# EAGLE design schematic (EAGLE 9.0.0)

## Sheet 1 of 4
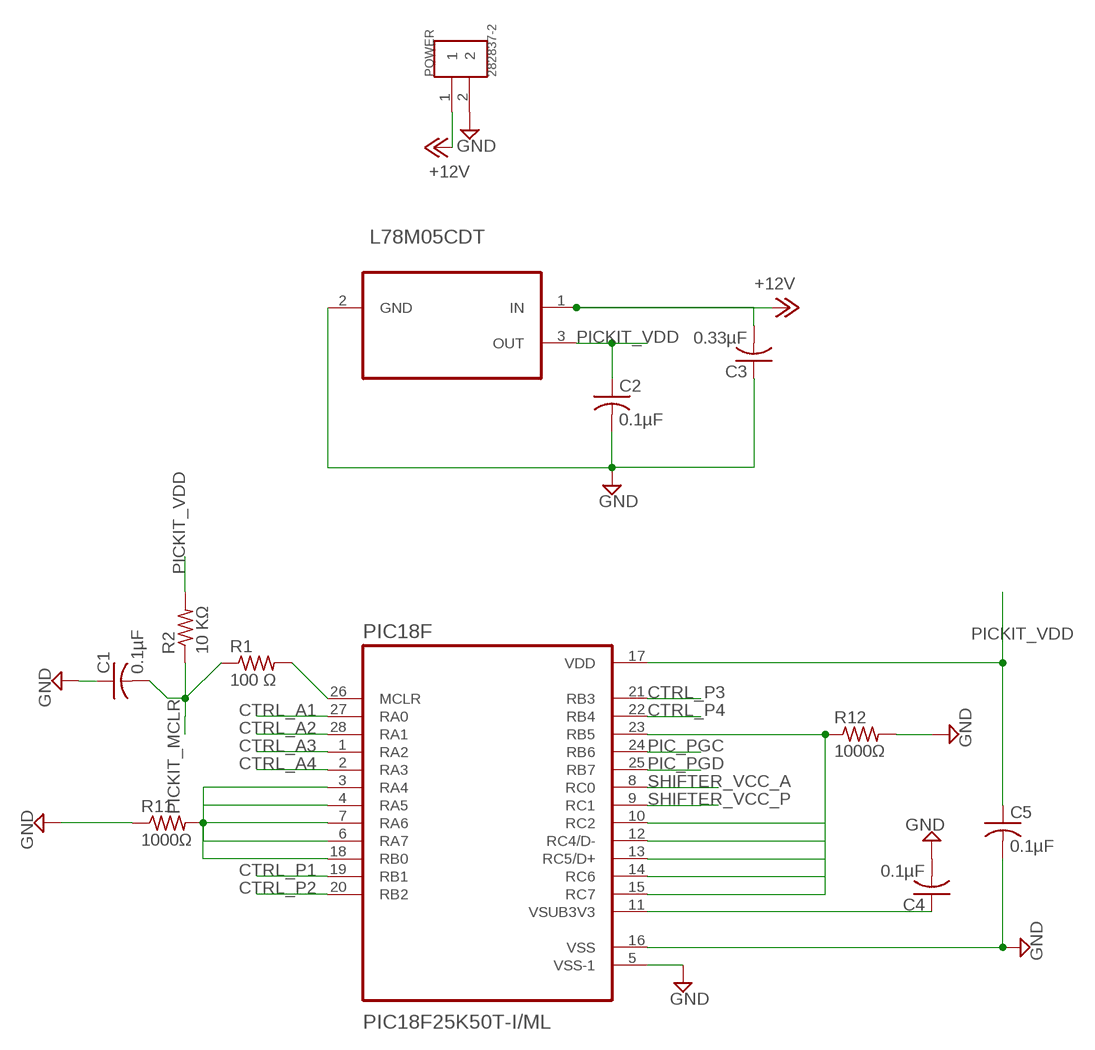
[diagram p0: schematic, sheet 1]

### Parts
C1  0.1µF  C-USC0603  [C0603]
C2  0.1µF  C-USC0603  [C0603]
C3  0.33µF  C-USC0603  [C0603]
C4  0.1µF  C-USC0603  [C0603]
C5  0.1µF  C-USC0603  [C0603]
L78M05CDT  L78M05CDT  [TO225P972X240-3N]
PIC18F  PIC18F25K50T-I/ML  [QFN65P600X600X100-29N]
POWER  282837-2  [TE_282837-2]
R1  100 Ω  R-US_R0805  [R0805]
R2  10 KΩ  R-US_R0805  [R0805]
R11  1000Ω  R-US_R0603  [R0603]
R12  1000Ω  R-US_R0603  [R0603]

### Nets
+12V: C3.2 L78M05CDT.1(IN) POWER.1 ; also sheet 2,3
CTRL_A1: PIC18F.27(RA0) ; also sheet 2
CTRL_A2: PIC18F.28(RA1) ; also sheet 2
CTRL_A3: PIC18F.1(RA2) ; also sheet 2
CTRL_A4: PIC18F.2(RA3) ; also sheet 2
CTRL_P1: PIC18F.19(RB1) ; also sheet 2
CTRL_P2: PIC18F.20(RB2) ; also sheet 2
CTRL_P3: PIC18F.21(RB3) ; also sheet 2
CTRL_P4: PIC18F.22(RB4) ; also sheet 2
GND: C1.1 C2.2 C3.1 C4.2 C5.2 L78M05CDT.2(GND) PIC18F.5(VSS-1) PIC18F.16(VSS) POWER.2 R11.1 R12.2 ; also sheet 2,3,4
N$1: C4.1 PIC18F.11(VSUB3V3)
N$3: PIC18F.3(RA4) PIC18F.4(RA5) PIC18F.6(RA7) PIC18F.7(RA6) PIC18F.18(RB0) R11.2
N$6: PIC18F.26(MCLR) R1.2
N$12: PIC18F.10(RC2) PIC18F.12(RC4/D-) PIC18F.13(RC5/D+) PIC18F.14(RC6) PIC18F.15(RC7) PIC18F.23(RB5) R12.1
PIC_PGC: PIC18F.24(RB6) ; also sheet 4
PIC_PGD: PIC18F.25(RB7) ; also sheet 4
PICKIT_MCLR: C1.2 R1.1 R2.1 ; also sheet 4
PICKIT_VDD: C2.1 C5.1 L78M05CDT.3(OUT) PIC18F.17(VDD) R2.2 ; also sheet 4
SHIFTER_VCC_A: PIC18F.8(RC0) ; also sheet 2
SHIFTER_VCC_P: PIC18F.9(RC1) ; also sheet 2

## Sheet 2 of 4
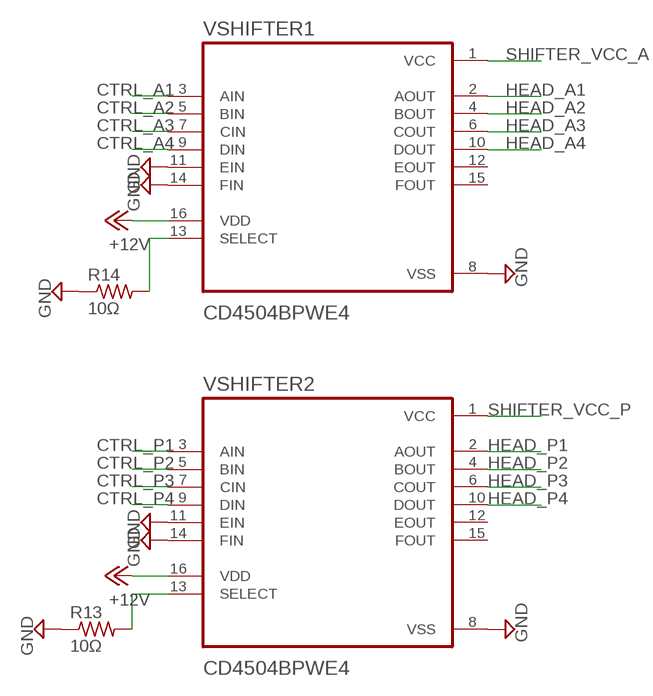
[diagram p1: schematic, sheet 2]

### Parts
R13  10Ω  R-US_R0603  [R0603]
R14  10Ω  R-US_R0603  [R0603]
VSHIFTER1  CD4504BPWE4  [SOP65P640X120-16N]
VSHIFTER2  CD4504BPWE4  [SOP65P640X120-16N]

### Nets
+12V: VSHIFTER1.16(VDD) VSHIFTER2.16(VDD) ; also sheet 1,3
CTRL_A1: VSHIFTER1.3(AIN) ; also sheet 1
CTRL_A2: VSHIFTER1.5(BIN) ; also sheet 1
CTRL_A3: VSHIFTER1.7(CIN) ; also sheet 1
CTRL_A4: VSHIFTER1.9(DIN) ; also sheet 1
CTRL_P1: VSHIFTER2.3(AIN) ; also sheet 1
CTRL_P2: VSHIFTER2.5(BIN) ; also sheet 1
CTRL_P3: VSHIFTER2.7(CIN) ; also sheet 1
CTRL_P4: VSHIFTER2.9(DIN) ; also sheet 1
GND: R13.1 R14.1 VSHIFTER1.8(VSS) VSHIFTER1.11(EIN) VSHIFTER1.14(FIN) VSHIFTER2.8(VSS) VSHIFTER2.11(EIN) VSHIFTER2.14(FIN) ; also sheet 1,3,4
HEAD_A1: VSHIFTER1.2(AOUT) ; also sheet 3
HEAD_A2: VSHIFTER1.4(BOUT) ; also sheet 3
HEAD_A3: VSHIFTER1.6(COUT) ; also sheet 3
HEAD_A4: VSHIFTER1.10(DOUT) ; also sheet 3
HEAD_P1: VSHIFTER2.2(AOUT) ; also sheet 3
HEAD_P2: VSHIFTER2.4(BOUT) ; also sheet 3
HEAD_P3: VSHIFTER2.6(COUT) ; also sheet 3
HEAD_P4: VSHIFTER2.10(DOUT) ; also sheet 3
N$13: R14.2 VSHIFTER1.13(SELECT)
N$14: R13.2 VSHIFTER2.13(SELECT)
SHIFTER_VCC_A: VSHIFTER1.1(VCC) ; also sheet 1
SHIFTER_VCC_P: VSHIFTER2.1(VCC) ; also sheet 1
Unconnected: VSHIFTER1.12(EOUT) VSHIFTER1.15(FOUT) VSHIFTER2.12(EOUT) VSHIFTER2.15(FOUT)

## Sheet 3 of 4
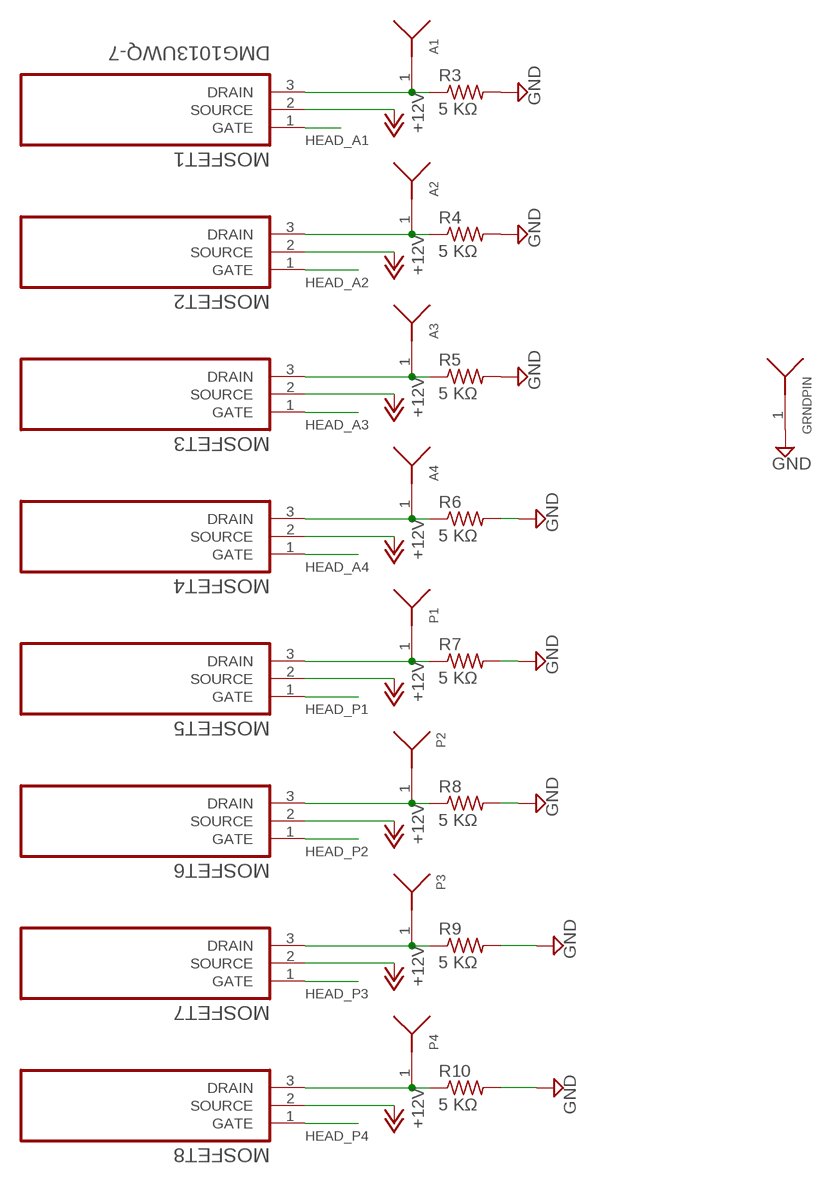
[diagram p2: schematic, sheet 3]

### Parts
A1  0930  [0930]
A2  0930  [0930]
A3  0930  [0930]
A4  0930  [0930]
GRNDPIN  0930  [0930]
MOSFET1  DMG1013UWQ-7  [SOT65P210X110-3N]
MOSFET2  DMG1013UWQ-7  [SOT65P210X110-3N]
MOSFET3  DMG1013UWQ-7  [SOT65P210X110-3N]
MOSFET4  DMG1013UWQ-7  [SOT65P210X110-3N]
MOSFET5  DMG1013UWQ-7  [SOT65P210X110-3N]
MOSFET6  DMG1013UWQ-7  [SOT65P210X110-3N]
MOSFET7  DMG1013UWQ-7  [SOT65P210X110-3N]
MOSFET8  DMG1013UWQ-7  [SOT65P210X110-3N]
P1  0930  [0930]
P2  0930  [0930]
P3  0930  [0930]
P4  0930  [0930]
R3  5 KΩ  R-US_R0603  [R0603]
R4  5 KΩ  R-US_R0603  [R0603]
R5  5 KΩ  R-US_R0603  [R0603]
R6  5 KΩ  R-US_R0603  [R0603]
R7  5 KΩ  R-US_R0603  [R0603]
R8  5 KΩ  R-US_R0603  [R0603]
R9  5 KΩ  R-US_R0603  [R0603]
R10  5 KΩ  R-US_R0603  [R0603]

### Nets
+12V: MOSFET1.2(SOURCE) MOSFET2.2(SOURCE) MOSFET3.2(SOURCE) MOSFET4.2(SOURCE) MOSFET5.2(SOURCE) MOSFET6.2(SOURCE) MOSFET7.2(SOURCE) MOSFET8.2(SOURCE) ; also sheet 1,2
GND: GRNDPIN.1 R3.2 R4.2 R5.2 R6.2 R7.2 R8.2 R9.2 R10.2 ; also sheet 1,2,4
HEAD_A1: MOSFET1.1(GATE) ; also sheet 2
HEAD_A2: MOSFET2.1(GATE) ; also sheet 2
HEAD_A3: MOSFET3.1(GATE) ; also sheet 2
HEAD_A4: MOSFET4.1(GATE) ; also sheet 2
HEAD_P1: MOSFET5.1(GATE) ; also sheet 2
HEAD_P2: MOSFET6.1(GATE) ; also sheet 2
HEAD_P3: MOSFET7.1(GATE) ; also sheet 2
HEAD_P4: MOSFET8.1(GATE) ; also sheet 2
N$2: A1.1 MOSFET1.3(DRAIN) R3.1
N$4: A2.1 MOSFET2.3(DRAIN) R4.1
N$5: A3.1 MOSFET3.3(DRAIN) R5.1
N$7: A4.1 MOSFET4.3(DRAIN) R6.1
N$8: MOSFET5.3(DRAIN) P1.1 R7.1
N$9: MOSFET6.3(DRAIN) P2.1 R8.1
N$10: MOSFET7.3(DRAIN) P3.1 R9.1
N$11: MOSFET8.3(DRAIN) P4.1 R10.1

## Sheet 4 of 4
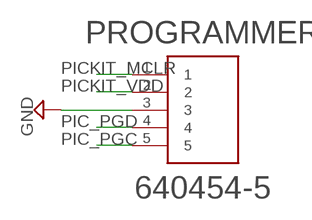
[diagram p3: schematic, sheet 4]

### Parts
PROGRAMMER  640454-5  [TE_640454-5]

### Nets
GND: PROGRAMMER.3 ; also sheet 1,2,3
PIC_PGC: PROGRAMMER.5 ; also sheet 1
PIC_PGD: PROGRAMMER.4 ; also sheet 1
PICKIT_MCLR: PROGRAMMER.1 ; also sheet 1
PICKIT_VDD: PROGRAMMER.2 ; also sheet 1

## Library data of the parts
A1-A4 GRNDPIN P1-P4 = 0930:0930: LOW PROFILE SPRING PIN; AVAILABILITY: Good; DESCRIPTION: SPRING LOADED PIN; Connector Tip Style: Point; Current Rating: 2A; Overall Length:; MF: Mill-Max Manufacturing; MP: 0926-1-15-20-75-14-11-0; OC_NEWARK: unknown; PACKAGE: None; PRICE: 0.56 USD
C1 C2 C4 C5 = rcl:C-US: CAPACITOR, American symbol; MPN: B32529C0104J000; OC_NEWARK: 26M8219; SPICEPREFIX: C
C3 = rcl:C-US: CAPACITOR, American symbol; OC_NEWARK: unknown; SPICEPREFIX: C
L78M05CDT = L78M05CDT:L78M05CDT: Positive voltage regulators; AVAILABILITY: Good; DESCRIPTION: L78M Series 500 mA 5 V Three Terminal Positive Voltage LDO Regulator - TO-252; MF: STMicroelectronics; MP: L78M05CDT-TR; PACKAGE: TO-252-3 STMicroelectronics; PRICE: 0.21 USD
MOSFET1-MOSFET8 = DMG1013UWQ-7:DMG1013UWQ-7: None; AVAILABILITY: Good; DESCRIPTION: Mosfet Bvdss: 8v~24v Sot323 t&r 3k; MP: DMG1013UWQ-7; OC_NEWARK: unknown; PACKAGE: SOT-323 Diodes Inc.; PRICE: 0.15 USD
PIC18F = PIC18F25K50T-I_ML:PIC18F25K50T-I/ML: None; AVAILABILITY: Good; DESCRIPTION: 32 KB Flash, 2048 bytes RAM, 48 MHz Int. Osc, 25 I/0, PIC18 Core, USB 2.0; MF: Microchip; MP: PIC18F25K50T-I/ML; OC_NEWARK: unknown; PACKAGE: QFN-28 Microchip; PRICE: 2.47 USD
POWER = 282837-2:282837-2: TERM BLOCK 5.08MM 2POS SIDE ENTY; AVAILABILITY: Good; DESCRIPTION: Connector, Terminal Block; Wire Receptacle; 2 Pos.; 16-30 AWG; 0.2 in. CL; Side;; MP: 282837-2; OC_NEWARK: unknown; PACKAGE: None; PRICE: 0.36 USD
PROGRAMMER = 640454-5:640454-5: CONN HEADER VERT 5POS .100 TIN; AVAILABILITY: Good; DESCRIPTION: MTA-100 5 Position 2.54 mm Single Row Through-Hole Straight Wire to Board Header; EU_ROHS_COMPLIANCE: Compliant; LINK: http://www.te.com/usa-en/product-640454-5.html; MP: 640454-5; OC_NEWARK: unknown; PACKAGE: None; PRICE: 0.15 USD
R1-R12 = resistor:R-US_: RESISTOR, American symbol; OC_NEWARK: unknown
R13 R14 = rcl:R-US_: RESISTOR, American symbol; SPICEPREFIX: R
VSHIFTER1 VSHIFTER2 = CD4504BPWE4:CD4504BPWE4: None; AVAILABILITY: Good; DESCRIPTION: CMOS Hex Voltage-Level Shifter for TTL-to-CMOS or CMOS-to-CMOS Operation 16-TSSOP -55 to 125; MP: CD4504BPWE4; OC_NEWARK: unknown; PACKAGE: TSSOP-16 Texas Instruments; PRICE: 0.26 USD

## Board
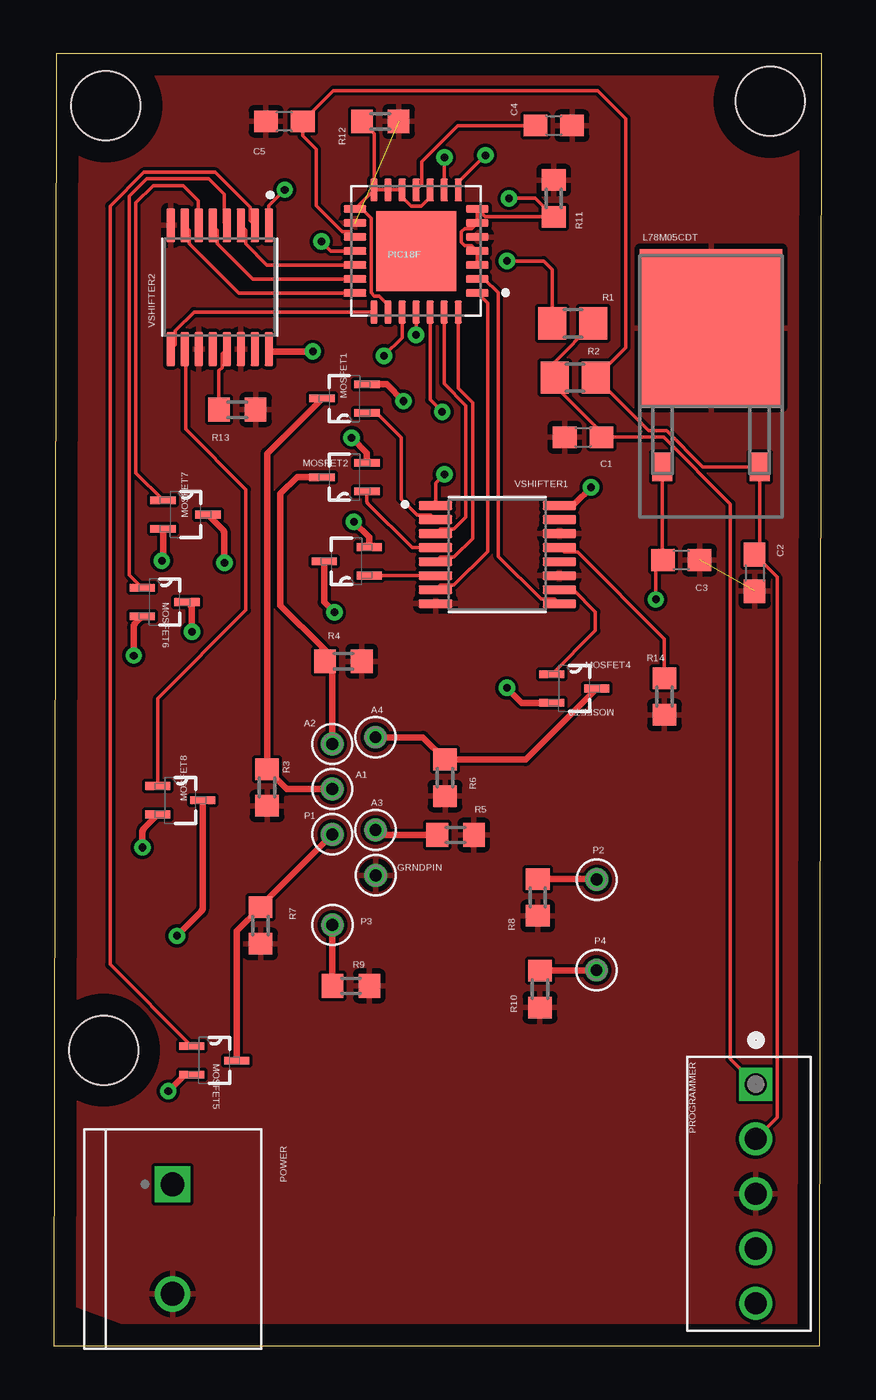
[diagram p4: board, top side]
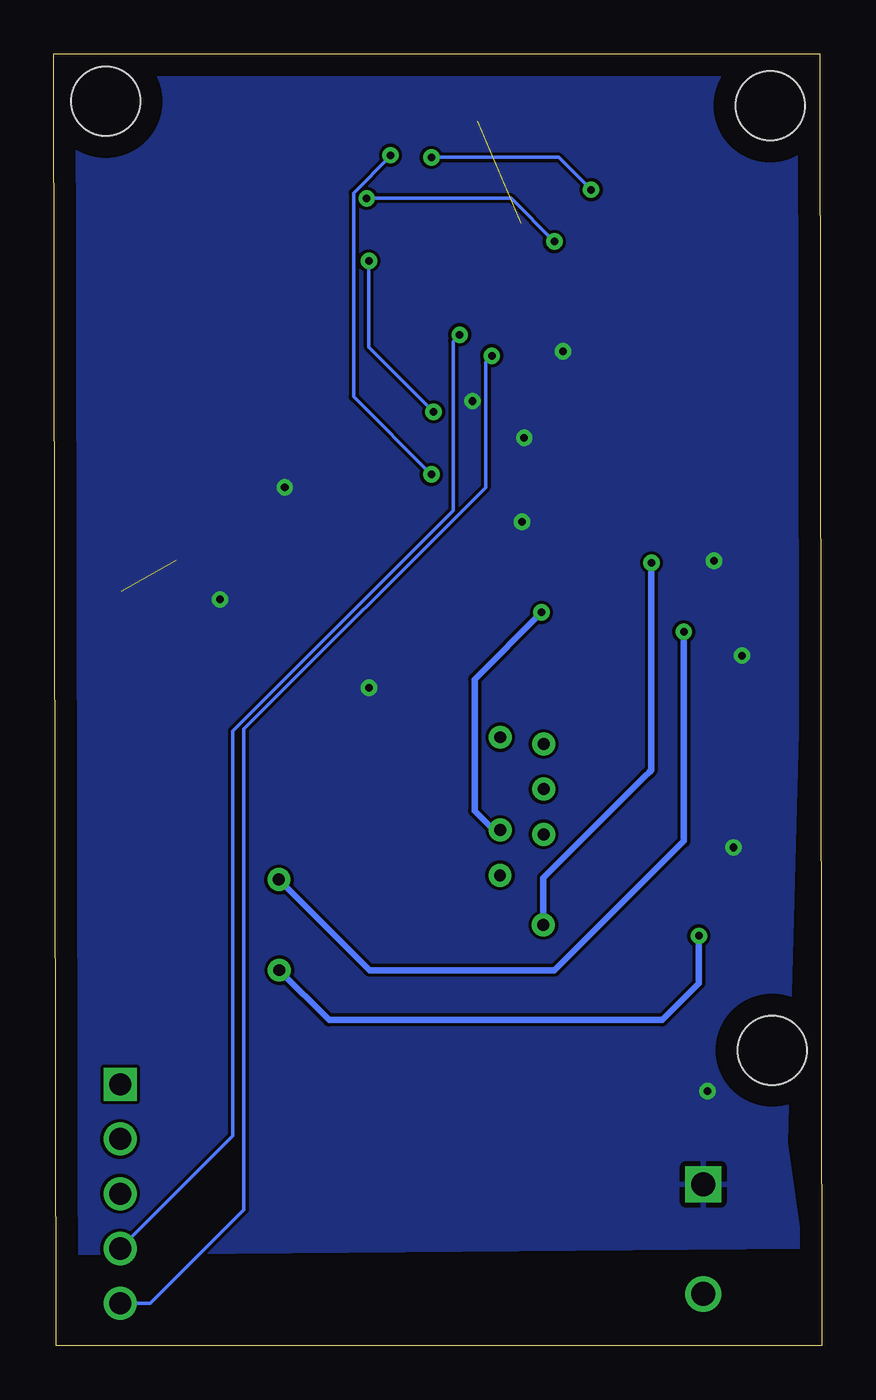
[diagram p5: board, bottom side, seen from below]

Size 35.6 x 59.9 mm. Coordinates in mm from the lower left corner, seen from the top.
Outline: 0,0 35.5,0 35.6,59.9 0.1,59.9 0,0
Copper layers (1*16): Top 0.035mm / dielectric 1.5mm / Bottom 0.035mm
Design rules "default": minimum track width 6mil, minimum drill 0.35mm, track to track 6mil, track to pad 6mil, pad to pad 6mil, via to via 6mil, smd to smd 6mil, copper to edge 40mil, drill to drill 6mil, minimum pad ring 10mil, minimum via ring 8mil, stop-mask expansion 4mil, vias tented up to drill 0mil, thermal gap 10mil
Holes 3.19 mm at 33.2,57.7 2.4,57.5 2.3,13.7

### Footprints (pad centres in the part's own frame; a part is rotated, then mirrored left to right if it is on the bottom)
0930 = drill 0.55: 1 0,0
C0603 = smd 1.1 x 1: 1 -0.85,0; 2 0.85,0
TO225P972X240-3N = smd 0.94 x 1.321: 1 -2.261,-6.299; 3 2.261,-6.299 | smd 6.604 x 7.315: 2 0,0.152
SOT65P210X110-3N = smd 1.168 x 0.356: 1 -1.041,0.66; 2 -1.041,-0.66; 3 1.041,0
QFN65P600X600X100-29N = smd 1.04 x 0.33: 1 -2.835,1.95; 2 -2.835,1.3; 3 -2.835,0.65; 4 -2.835,0; 5 -2.835,-0.65; 6 -2.835,-1.3; 7 -2.835,-1.95; 15 2.835,-1.95; 16 2.835,-1.3; 17 2.835,-0.65; 18 2.835,0; 19 2.835,0.65; 20 2.835,1.3; 21 2.835,1.95 | smd 0.33 x 1.04: 8 -1.95,-2.835; 9 -1.3,-2.835; 10 -0.65,-2.835; 11 0,-2.835; 12 0.65,-2.835; 13 1.3,-2.835; 14 1.95,-2.835; 22 1.95,2.835; 23 1.3,2.835; 24 0.65,2.835; 25 0,2.835; 26 -0.65,2.835; 27 -1.3,2.835; 28 -1.95,2.835 | smd 3.7 x 3.7: 29 0,0
TE_282837-2 = drill 1.1 square: 1 -2.54,0 | drill 1.1: 2 2.54,0
TE_640454-5 = drill 1.02 square: 1 -5.08,0 | drill 1.02: 2 -2.54,0; 3 0,0; 4 2.54,0; 5 5.08,0
R0805 = smd 1.3 x 1.5: 1 -0.95,0; 2 0.95,0
R0603 = smd 1 x 1.1: 1 -0.85,0; 2 0.85,0
SOP65P640X120-16N = smd 1.57 x 0.41: 1 -2.87,2.275; 2 -2.87,1.625; 3 -2.87,0.975; 4 -2.87,0.325; 5 -2.87,-0.325; 6 -2.87,-0.975; 7 -2.87,-1.625; 8 -2.87,-2.275; 9 2.87,-2.275; 10 2.87,-1.625; 11 2.87,-0.975; 12 2.87,-0.325; 13 2.87,0.325; 14 2.87,0.975; 15 2.87,1.625; 16 2.87,2.275

### Placement (x,y rotation side)
A1  12.9,25.81 0 top
A2  12.9,27.9 0 top
A3  14.91,23.91 0 top
A4  14.91,28.21 0 top
C1  24.53,42.12 0 top
C2  32.48,35.83 270 top
C3  29.08,36.43 180 top
C4  23.17,56.58 0 top
C5  10.68,56.77 180 top
GRNDPIN  14.92,21.81 0 top
L78M05CDT  30.46,47.04 0 top
MOSFET1  13.47,43.92 180 top
MOSFET2  13.47,40.27 180 top
MOSFET3  13.57,36.37 180 top
MOSFET4  24.12,30.47 0 top
MOSFET5  7.43,13.22 0 top
MOSFET6  5.13,34.48 0 top
MOSFET7  6.1,38.54 0 top
MOSFET8  5.86,25.29 0 top
P1  12.9,23.71 0 top
P2  25.17,21.61 0 top
P3  12.91,19.51 0 top
P4  25.15,17.41 0 top
PIC18F  16.79,50.76 180 top
POWER  5.5,4.94 270 top
PROGRAMMER  32.53,7.04 270 top
R1  24.06,47.41 180 top
R2  24.16,44.89 0 top
R3  9.88,25.88 270 top
R4  13.42,31.73 0 top
R5  18.62,23.68 0 top
R6  18.13,26.33 270 top
R7  9.58,19.48 270 top
R8  22.43,20.78 270 top
R9  13.77,16.68 0 top
R10  22.53,16.53 270 top
R11  23.17,53.2 270 top
R12  15.13,56.77 0 top
R13  8.5,43.4 180 top
R14  28.3,30.1 90 top
VSHIFTER1  20.56,36.68 0 top
VSHIFTER2  7.69,49.08 270 top

### Tracks (layer width: path | path; a pad name or v marks a point on that pad's centre or on a via)
+12V  (via drill 0.35)
  Top 0.152: L78M05CDT.1 28.2,36.46 | C3.2 27.9,36.1 v27.9,34.6
  Top 0.305: MOSFET5.2 6.06,12.56 v5.3,11.8 | 28.2,36.46 C3.2 | MOSFET1.2 15.42,44.58 v16.2,43.8 | MOSFET4.2 21.69,29.81 v21,30.5 | MOSFET3.2 14.61,37.49 v13.9,38.2 | MOSFET2.2 14.51,41.39 v13.8,42.1 | MOSFET7.2 5.06,36.54 arc-45 v5,36.4 | MOSFET6.2 3.79,33.52 arc45 3.7,33.3 v3.7,32 | MOSFET8.2 4.19,24 arc45 4.1,23.79 v4.1,23.1 | VSHIFTER2.16 9.99,46.19 arc45 10.2,46.1 v12,46.1 | VSHIFTER1.16 23.93,38.95 arc45 24.14,39.04 v24.9,39.8
  pour Bottom: 31.4,60.3 1.7,60.1 0.3,57.9 1.6,9.4 0.9,4.5 35.1,4.2 36.4,11 35.9,59 34.6,60.3
CTRL_A1
  Top 0.152: VSHIFTER1.3 17.91,37.87 18.54,37.87 19.1,38.43 19.1,43.6 18.1,44.6 PIC18F.27
CTRL_A2
  Top 0.152: VSHIFTER1.5 17.91,36.57 18.54,36.57 19.41,37.44 19.41,43.73 18.74,44.39 PIC18F.28
CTRL_A3
  Top 0.152: VSHIFTER1.7 17.91,35.27 18.54,35.27 20.1,36.83 20.1,48.34 PIC18F.1
CTRL_A4
  Top 0.152: VSHIFTER1.9 23.21,34.62 22.58,34.62 20.6,36.6 20.6,48.82 19.96,49.46 PIC18F.2
CTRL_P1
  Top 0.152: VSHIFTER2.3 8.88,51.73 8.88,51.1 9.87,50.11 PIC18F.19
CTRL_P2
  Top 0.152: VSHIFTER2.5 7.58,51.73 7.58,51.1 9.22,49.46 PIC18F.20
CTRL_P3
  Top 0.152: VSHIFTER2.7 6.28,51.73 6.28,51.1 8.57,48.81 PIC18F.21
CTRL_P4
  Top 0.152: PIC18F.22 6.5,47.92 5.63,47.06 5.63,46.43 VSHIFTER2.9
GND  (2 unrouted)
  pour Top: -0.3,60.2 -1.4,2.7 3.6,0.85 34.2,0.85 36.5,0.5 39.8,57.7 36.6,61.7 1.4,62.2 -0.2,60.3
HEAD_A1
  Top 0.152: VSHIFTER1.2 17.47,38.52 16.84,38.52 16.1,39.26 16.1,42.1 14.94,43.26 MOSFET1.1
HEAD_A2
  Top 0.152: MOSFET2.1 14.51,39.15 arc45 14.56,39.04 16.6,37 17.68,37 arc45 VSHIFTER1.4
HEAD_A3
  Top 0.152: MOSFET3.1 VSHIFTER1.6 arc-45 VSHIFTER1.6
  Top 0.305: VSHIFTER1.6
HEAD_A4
  Top 0.152: MOSFET4.1 25.1,33.15 25.1,34.02 24.06,35.05 VSHIFTER1.10
HEAD_P1
  Top 0.152: VSHIFTER2.2 9.1,52.17 9.1,52.8 7.49,54.41 4.17,54.41 2.6,52.84 2.6,17.67 MOSFET5.1
HEAD_P2
  Top 0.152: VSHIFTER2.4 7.89,52.08 7.89,53.41 7.19,54.1 4.29,54.1 3.5,53.3 3.5,35.73 MOSFET6.1
HEAD_P3
  Top 0.152: VSHIFTER2.6 6.7,51.96 6.7,53.1 6,53.8 4.6,53.8 3.8,53 3.8,40.46 MOSFET7.1
HEAD_P4
  Top 0.152: MOSFET8.1 4.82,30.02 8.9,34.1 8.9,39.7 6.1,42.5 6.1,46.17 VSHIFTER2.10
N$1
  Top 0.152: PIC18F.11 17.05,53.85 17.05,54.91 18.72,56.58 C4.1
N$2
  Top 0.305: A1.1 10.8,25.81 R3.1 9.88,41.37 MOSFET1.3
N$3  (via drill 0.35)
  Top 0.152: PIC18F.3 PIC18F.4 19.37,51.02 19.03,51.02 18.88,51.17 18.88,51.65 19.03,51.8 19.37,51.8 PIC18F.6 PIC18F.7 19.99,52.35 R11.2 22.32,53.2 v21.1,53.2 | PIC18F.18 12.84,50.76 v12.4,51.2
  Bottom 0.152: v12.4,51.2 14.4,53.2 v21.1,53.2
N$4
  Top 0.305: 12.43,32.4 12.43,31.87 R4.1 | A2.1 12.9,31.93 12.43,32.4 | MOSFET2.3 11.27,40.27 10.5,39.5 10.5,34.33 12.43,32.4
N$5  (via drill 0.35)
  Top 0.305: A3.1 15.14,23.68 R5.1 | MOSFET3.3 12.53,34.47 v13,34
  Bottom 0.305: v13,34 16.1,30.9 16.1,24.8 15.21,23.91 A3.1
N$6  (via drill 0.35)
  Top 0.152: PIC18F.26 17.44,43.86 v18,43.3 | v21,50.3 22.7,50.3 23.1,49.9 R1.2
  Bottom 0.152: v18,43.3 21,46.3 v21,50.3
N$7
  Top 0.305: A4.1 17.1,28.21 R6.1 21.87,27.18 MOSFET4.3
N$8
  Top 0.305: MOSFET5.3 8.47,19.22 R7.1 9.58,20.39 P1.1
N$9  (via drill 0.35)
  Top 0.305: MOSFET6.3 6.4,34.25 v6.4,33.1 | R8.1 25.15,21.63 P2.1
  Bottom 0.305: v6.4,33.1 6.4,23.4 12.4,17.4 20.96,17.4 P2.1
N$10  (via drill 0.35)
  Top 0.305: P3.1 R9.1 | MOSFET7.3 7.81,37.87 arc-45 7.9,37.66 v7.9,36.3
  Bottom 0.305: P3.1 12.91,21.69 8.2,26.4 7.99,26.61 | 7.99,26.61 7.9,26.7 | v7.9,36.3 7.9,26.83 arc45 7.99,26.61
N$11  (via drill 0.35)
  Top 0.305: R10.1 22.56,17.41 P4.1 | MOSFET8.3 6.9,20.33 arc-45 6.81,20.11 v5.7,19
  Bottom 0.305: v5.7,19 5.7,16.8 7.4,15.1 22.84,15.1 P4.1
N$12
  Top 0.152: PIC18F.23 15.49,48.26 15.08,48.67 14.85,48.67 14.71,48.82 14.71,52.29 14.29,52.71 PIC18F.15 PIC18F.14 | PIC18F.14 PIC18F.13 PIC18F.12 16.14,53.26 16.55,52.85 17.03,52.85 17.44,53.26 PIC18F.10 | R12.1 14.84,56.21 PIC18F.14
N$13
  Top 0.152: VSHIFTER1.13 23.65,36.79 24.28,36.79 28.3,32.77 R14.2
N$14
  Top 0.152: R13.2 7.65,45.21 7.8,45.36 7.8,45.99 VSHIFTER2.13
PIC_PGC  (via drill 0.35)
  Top 0.152: PIC18F.24 16.14,46.74 v15.3,45.9
  Bottom 0.152: v15.3,45.9 15.59,45.61 15.59,39.79 26.8,28.58 26.8,6.3 31.14,1.96 PROGRAMMER.5
PIC_PGD  (via drill 0.35)
  Top 0.152: PIC18F.25 v16.79,46.87
  Bottom 0.152: v16.79,46.87 17.1,46.56 17.1,38.71 27.3,28.51 27.3,9.73 PROGRAMMER.4
PICKIT_MCLR
  Top 0.152: C1.2 25.6,42.12 | 25.6,42.12 28.27,42.12 31.36,39.03 31.36,13.29 PROGRAMMER.1 | R1.1 23.21,45.61 R2.1 23.21,44.51 25.6,42.12
PICKIT_VDD
  Top 0.152: PIC18F.17 13.7,51.67 13.36,51.67 12.16,52.87 12.16,55.48 11.53,56.1 C5.1 | PROGRAMMER.2 33.52,10.57 33.52,35.64 C2.1 32.72,36.92 L78M05CDT.3 30.08,40.74 28.4,42.42 27.58,42.42 R2.2 26.5,46.28 26.5,56.9 25.2,58.2 12.96,58.2 C5.1 | C5.1 11.67,56.77
SHIFTER_VCC_A  (via drill 0.35)
  Top 0.152: PIC18F.8 18.74,53.94 v20,55.2 | v18.1,40.4 17.69,39.99 VSHIFTER1.1
  Bottom 0.152: v20,55.2 20,55.16 21.71,53.45 21.71,44.01 v18.1,40.4
SHIFTER_VCC_P  (via drill 0.35)
  Top 0.152: PIC18F.9 v18.09,55.09 v18.1,55.1 | v10.7,53.6 9.96,52.87 VSHIFTER2.1
  Bottom 0.152: v18.1,55.1 12.2,55.1 v10.7,53.6